# EAGLE schematic sch1 (EAGLE 9.6.2)
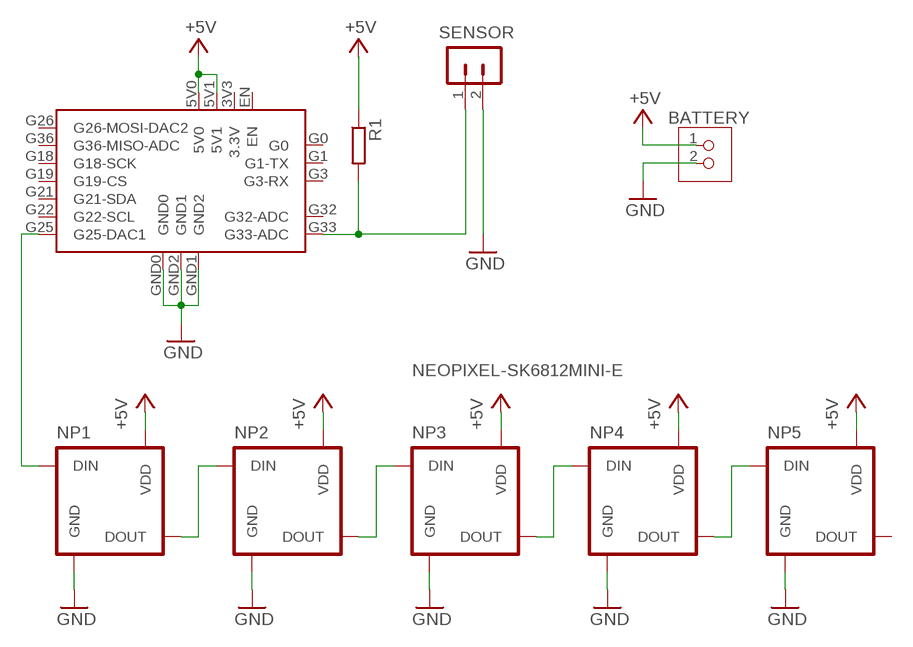
[diagram p0: schematic, sheet 1]

## Parts
M5PICO1  M5STAMP-PICO  [M5STAMP-PICO]
NP1  NEOPIXEL-SK6812MINI-E  [SK6812MINI-E]
NP2  NEOPIXEL-SK6812MINI-E  [SK6812MINI-E]
NP3  NEOPIXEL-SK6812MINI-E  [SK6812MINI-E]
NP4  NEOPIXEL-SK6812MINI-E  [SK6812MINI-E]
NP5  NEOPIXEL-SK6812MINI-E  [SK6812MINI-E]
P1  BATTERY  JST-PH2  [JST-PH2]
R1  R-EU_0204/7  [0204/7]
SV1  SENSOR  PINHEAD-MA02-1  [PINHEAD-MA02-1]

## Nets
+5V: M5PICO1.5V0 M5PICO1.5V1 NP1.VDD NP2.VDD NP3.VDD NP4.VDD NP5.VDD P1.1 R1.1
GND: M5PICO1.GND0 M5PICO1.GND1(GND2) M5PICO1.GND2(GND1) NP1.GND NP2.GND NP3.GND NP4.GND NP5.GND P1.2 SV1.2
N$1: NP1.DOUT NP2.DIN
N$2: NP2.DOUT NP3.DIN
N$3: NP3.DOUT NP4.DIN
N$4: NP4.DOUT NP5.DIN
N$5: M5PICO1.G25(G25-DAC1) NP1.DIN
N$6: M5PICO1.G33(G33-ADC) R1.2 SV1.1
Unconnected: M5PICO1.3V3(3.3V) M5PICO1.EN M5PICO1.G0 M5PICO1.G1(G1-TX) M5PICO1.G3(G3-RX) M5PICO1.G18(G18-SCK) M5PICO1.G19(G19-CS) M5PICO1.G21(G21-SDA) M5PICO1.G22(G22-SCL) M5PICO1.G26(G26-MOSI-DAC2) M5PICO1.G32(G32-ADC) M5PICO1.G36(G36-MISO-ADC) NP5.DOUT

## Library data of the parts
M5PICO1 = ytani1:M5STAMP-PICO: M5Stamp Pico; URL: https://shop.m5stack.com/collections/m5stack-new-arrival/products/m5stamp-pico-mate-with-pin-headers?variant=40279458840748
NP1-NP5 = ytani1:NEOPIXEL
P1 = ytani1:JST-PH2
R1 = rcl:R-EU_: RESISTOR, European symbol; SPICEPREFIX: R
SV1 = ytani1:PINHEAD-MA02-1: PIN HEADER